# EAGLE design 180216RGDS_esquematico_Y7 (EAGLE 8.4.2)
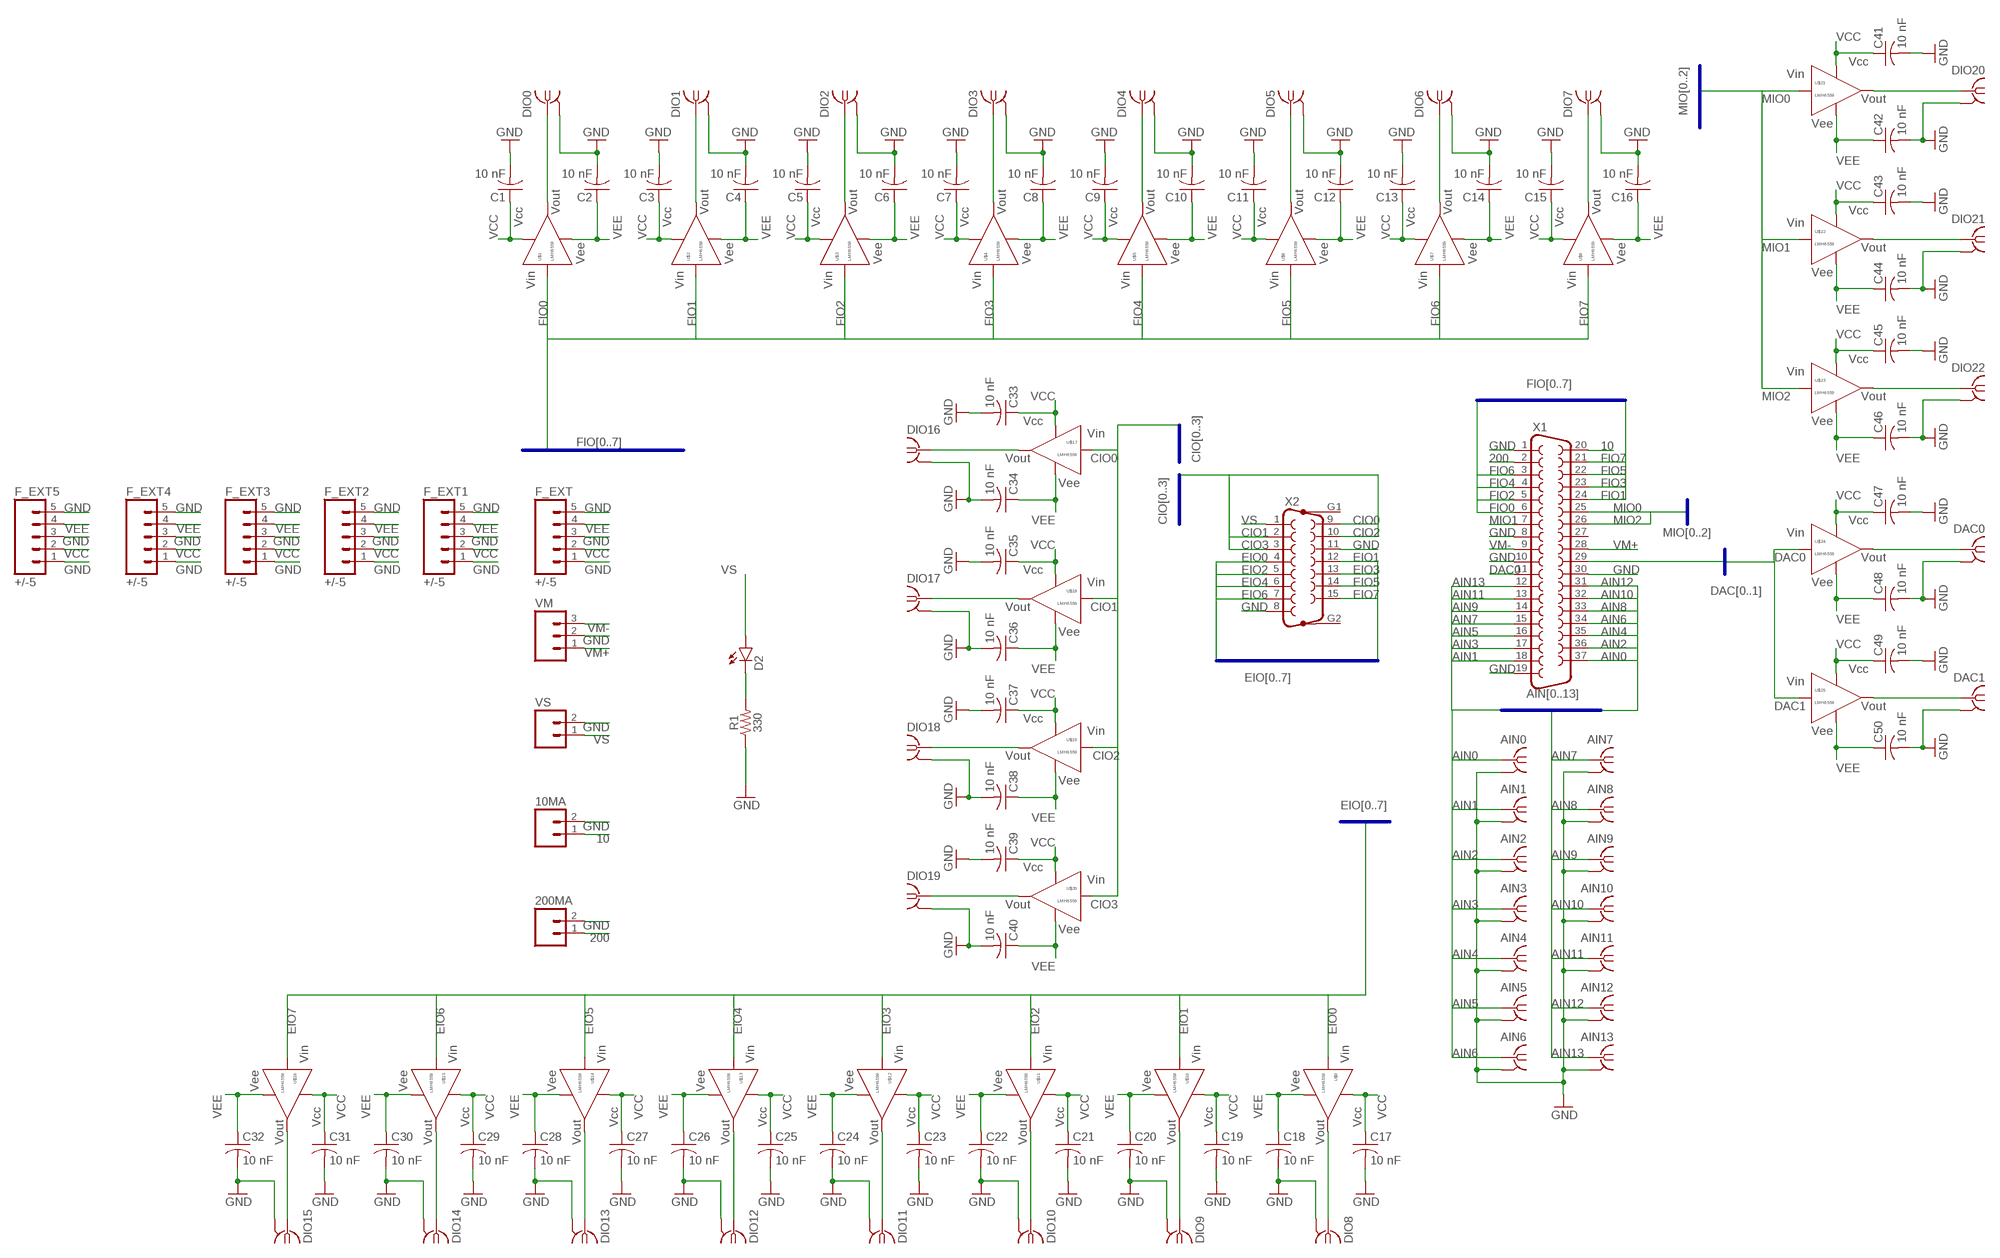
[diagram p0: schematic, sheet 1]

## Parts
10MA  M02PTH  [1X02]
200MA  M02PTH  [1X02]
AIN0  TE5227222-1  [VERTICAL_PCB&PANEL_TE]
AIN1  TE5227222-1  [VERTICAL_PCB&PANEL_TE]
AIN2  TE5227222-1  [VERTICAL_PCB&PANEL_TE]
AIN3  TE5227222-1  [VERTICAL_PCB&PANEL_TE]
AIN4  TE5227222-1  [VERTICAL_PCB&PANEL_TE]
AIN5  TE5227222-1  [VERTICAL_PCB&PANEL_TE]
AIN6  TE5227222-1  [VERTICAL_PCB&PANEL_TE]
AIN7  TE5227222-1  [VERTICAL_PCB&PANEL_TE]
AIN8  TE5227222-1  [VERTICAL_PCB&PANEL_TE]
AIN9  TE5227222-1  [VERTICAL_PCB&PANEL_TE]
AIN10  TE5227222-1  [VERTICAL_PCB&PANEL_TE]
AIN11  TE5227222-1  [VERTICAL_PCB&PANEL_TE]
AIN12  TE5227222-1  [VERTICAL_PCB&PANEL_TE]
AIN13  TE5227222-1  [VERTICAL_PCB&PANEL_TE]
C1  10 nF  C-USC1206K  [C1206K]
C2  10 nF  C-USC1206K  [C1206K]
C3  10 nF  C-USC1206K  [C1206K]
C4  10 nF  C-USC1206K  [C1206K]
C5  10 nF  C-USC1206K  [C1206K]
C6  10 nF  C-USC1206K  [C1206K]
C7  10 nF  C-USC1206K  [C1206K]
C8  10 nF  C-USC1206K  [C1206K]
C9  10 nF  C-USC1206K  [C1206K]
C10  10 nF  C-USC1206K  [C1206K]
C11  10 nF  C-USC1206K  [C1206K]
C12  10 nF  C-USC1206K  [C1206K]
C13  10 nF  C-USC1206K  [C1206K]
C14  10 nF  C-USC1206K  [C1206K]
C15  10 nF  C-USC1206K  [C1206K]
C16  10 nF  C-USC1206K  [C1206K]
C17  10 nF  C-USC1206K  [C1206K]
C18  10 nF  C-USC1206K  [C1206K]
C19  10 nF  C-USC1206K  [C1206K]
C20  10 nF  C-USC1206K  [C1206K]
C21  10 nF  C-USC1206K  [C1206K]
C22  10 nF  C-USC1206K  [C1206K]
C23  10 nF  C-USC1206K  [C1206K]
C24  10 nF  C-USC1206K  [C1206K]
C25  10 nF  C-USC1206K  [C1206K]
C26  10 nF  C-USC1206K  [C1206K]
C27  10 nF  C-USC1206K  [C1206K]
C28  10 nF  C-USC1206K  [C1206K]
C29  10 nF  C-USC1206K  [C1206K]
C30  10 nF  C-USC1206K  [C1206K]
C31  10 nF  C-USC1206K  [C1206K]
C32  10 nF  C-USC1206K  [C1206K]
C33  10 nF  C-USC1206K  [C1206K]
C34  10 nF  C-USC1206K  [C1206K]
C35  10 nF  C-USC1206K  [C1206K]
C36  10 nF  C-USC1206K  [C1206K]
C37  10 nF  C-USC1206K  [C1206K]
C38  10 nF  C-USC1206K  [C1206K]
C39  10 nF  C-USC1206K  [C1206K]
C40  10 nF  C-USC1206K  [C1206K]
C41  10 nF  C-USC1206K  [C1206K]
C42  10 nF  C-USC1206K  [C1206K]
C43  10 nF  C-USC1206K  [C1206K]
C44  10 nF  C-USC1206K  [C1206K]
C45  10 nF  C-USC1206K  [C1206K]
C46  10 nF  C-USC1206K  [C1206K]
C47  10 nF  C-USC1206K  [C1206K]
C48  10 nF  C-USC1206K  [C1206K]
C49  10 nF  C-USC1206K  [C1206K]
C50  10 nF  C-USC1206K  [C1206K]
D2  LED5MM  [LED5MM]
DAC0  TE5227222-1  [VERTICAL_PCB&PANEL_TE]
DAC1  TE5227222-1  [VERTICAL_PCB&PANEL_TE]
DIO0  TE5227222-1  [VERTICAL_PCB&PANEL_TE]
DIO1  TE5227222-1  [VERTICAL_PCB&PANEL_TE]
DIO2  TE5227222-1  [VERTICAL_PCB&PANEL_TE]
DIO3  TE5227222-1  [VERTICAL_PCB&PANEL_TE]
DIO4  TE5227222-1  [VERTICAL_PCB&PANEL_TE]
DIO5  TE5227222-1  [VERTICAL_PCB&PANEL_TE]
DIO6  TE5227222-1  [VERTICAL_PCB&PANEL_TE]
DIO7  TE5227222-1  [VERTICAL_PCB&PANEL_TE]
DIO8  TE5227222-1  [VERTICAL_PCB&PANEL_TE]
DIO9  TE5227222-1  [VERTICAL_PCB&PANEL_TE]
DIO10  TE5227222-1  [VERTICAL_PCB&PANEL_TE]
DIO11  TE5227222-1  [VERTICAL_PCB&PANEL_TE]
DIO12  TE5227222-1  [VERTICAL_PCB&PANEL_TE]
DIO13  TE5227222-1  [VERTICAL_PCB&PANEL_TE]
DIO14  TE5227222-1  [VERTICAL_PCB&PANEL_TE]
DIO15  TE5227222-1  [VERTICAL_PCB&PANEL_TE]
DIO16  TE5227222-1  [VERTICAL_PCB&PANEL_TE]
DIO17  TE5227222-1  [VERTICAL_PCB&PANEL_TE]
DIO18  TE5227222-1  [VERTICAL_PCB&PANEL_TE]
DIO19  TE5227222-1  [VERTICAL_PCB&PANEL_TE]
DIO20  TE5227222-1  [VERTICAL_PCB&PANEL_TE]
DIO21  TE5227222-1  [VERTICAL_PCB&PANEL_TE]
DIO22  TE5227222-1  [VERTICAL_PCB&PANEL_TE]
F_EXT  +/-5  M05PTH  [1X05]
F_EXT1  +/-5  M05PTH  [1X05]
F_EXT2  +/-5  M05PTH  [1X05]
F_EXT3  +/-5  M05PTH  [1X05]
F_EXT4  +/-5  M05PTH  [1X05]
F_EXT5  +/-5  M05PTH  [1X05]
R1  330  330OHM-HORIZ-1/10W-5%  [AXIAL-0.3]
U$1  LMH6559  [SO08]
U$2  LMH6559  [SO08]
U$3  LMH6559  [SO08]
U$4  LMH6559  [SO08]
U$5  LMH6559  [SO08]
U$6  LMH6559  [SO08]
U$7  LMH6559  [SO08]
U$8  LMH6559  [SO08]
U$9  LMH6559  [SO08]
U$10  LMH6559  [SO08]
U$11  LMH6559  [SO08]
U$12  LMH6559  [SO08]
U$13  LMH6559  [SO08]
U$14  LMH6559  [SO08]
U$15  LMH6559  [SO08]
U$16  LMH6559  [SO08]
U$17  LMH6559  [SO08]
U$18  LMH6559  [SO08]
U$19  LMH6559  [SO08]
U$20  LMH6559  [SO08]
U$21  LMH6559  [SO08]
U$22  LMH6559  [SO08]
U$23  LMH6559  [SO08]
U$24  LMH6559  [SO08]
U$25  LMH6559  [SO08]
VM  M03PTH  [1X03]
VS  M02PTH  [1X02]
X1  F37HP  [F37HP]
X2  F15HP  [F15HP]

## Nets
10: 10MA.1 X1.20
200: 200MA.1 X1.2
AIN0: AIN0.S X1.37
AIN1: AIN1.S X1.18
AIN2: AIN2.S X1.36
AIN3: AIN3.S X1.17
AIN4: AIN4.S X1.35
AIN5: AIN5.S X1.16
AIN6: AIN6.S X1.34
AIN7: AIN7.S X1.15
AIN8: AIN8.S X1.33
AIN9: AIN9.S X1.14
AIN10: AIN10.S X1.32
AIN11: AIN11.S X1.13
AIN12: AIN12.S X1.31
AIN13: AIN13.S X1.12
CIO0: U$17.4(VIN) X2.9
CIO1: U$18.4(VIN) X2.2
CIO2: U$19.4(VIN) X2.10
CIO3: U$20.4(VIN) X2.3
DAC0: U$24.4(VIN) X1.11
DAC1: U$25.4(VIN) X1.29
EIO0: U$9.4(VIN) X2.4
EIO1: U$10.4(VIN) X2.12
EIO2: U$11.4(VIN) X2.5
EIO3: U$12.4(VIN) X2.13
EIO4: U$13.4(VIN) X2.6
EIO5: U$14.4(VIN) X2.14
EIO6: U$15.4(VIN) X2.7
EIO7: U$16.4(VIN) X2.15
FIO0: U$1.4(VIN) X1.6
FIO1: U$2.4(VIN) X1.24
FIO2: U$3.4(VIN) X1.5
FIO3: U$4.4(VIN) X1.23
FIO4: U$5.4(VIN) X1.4
FIO5: U$6.4(VIN) X1.22
FIO6: U$7.4(VIN) X1.3
FIO7: U$8.4(VIN) X1.21
GND: 10MA.2 200MA.2 AIN0.G AIN1.G AIN2.G AIN3.G AIN4.G AIN5.G AIN6.G AIN7.G AIN8.G AIN9.G AIN10.G AIN11.G AIN12.G AIN13.G C1.2 C2.2 C3.2 C4.2 C5.2 C6.2 C7.2 C8.2 C9.2 C10.2 C11.2 C12.2 C13.2 C14.2 C15.2 C16.2 C17.2 C18.2 C19.2 C20.2 C21.2 C22.2 C23.2 C24.2 C25.2 C26.2 C27.2 C28.2 C29.2 C30.2 C31.2 C32.2 C33.2 C34.2 C35.2 C36.2 C37.2 C38.2 C39.2 C40.2 C41.2 C42.2 C43.2 C44.2 C45.2 C46.2 C47.2 C48.2 C49.2 C50.2 DAC0.G DAC1.G DIO0.G DIO1.G DIO2.G DIO3.G DIO4.G DIO5.G DIO6.G DIO7.G DIO8.G DIO9.G DIO10.G DIO11.G DIO12.G DIO13.G DIO14.G DIO15.G DIO16.G DIO17.G DIO18.G DIO19.G DIO20.G DIO21.G DIO22.G F_EXT1.1 F_EXT1.3 F_EXT1.5 F_EXT2.1 F_EXT2.3 F_EXT2.5 F_EXT3.1 F_EXT3.3 F_EXT3.5 F_EXT4.1 F_EXT4.3 F_EXT4.5 F_EXT5.1 F_EXT5.3 F_EXT5.5 F_EXT.1 F_EXT.3 F_EXT.5 R1.P$1 VM.2 VS.2 X1.1 X1.8 X1.10 X1.19 X1.30 X2.8 X2.11
MIO0: U$21.4(VIN) X1.25
MIO1: U$22.4(VIN) X1.7
MIO2: U$23.4(VIN) X1.26
N$1: DIO0.S U$1.8(VOUT)
N$3: D2.K(C) R1.P$2
N$4: DIO1.S U$2.8(VOUT)
N$5: DIO2.S U$3.8(VOUT)
N$6: DIO3.S U$4.8(VOUT)
N$7: DIO4.S U$5.8(VOUT)
N$8: DIO5.S U$6.8(VOUT)
N$9: DIO6.S U$7.8(VOUT)
N$10: DIO7.S U$8.8(VOUT)
N$11: DIO8.S U$9.8(VOUT)
N$12: DIO9.S U$10.8(VOUT)
N$13: DIO10.S U$11.8(VOUT)
N$14: DIO11.S U$12.8(VOUT)
N$15: DIO12.S U$13.8(VOUT)
N$16: DIO13.S U$14.8(VOUT)
N$17: DIO14.S U$15.8(VOUT)
N$18: DIO15.S U$16.8(VOUT)
N$19: DIO16.S U$17.8(VOUT)
N$20: DIO17.S U$18.8(VOUT)
N$21: DIO18.S U$19.8(VOUT)
N$22: DIO19.S U$20.8(VOUT)
N$23: DIO20.S U$21.8(VOUT)
N$24: DIO21.S U$22.8(VOUT)
N$25: DIO22.S U$23.8(VOUT)
N$26: DAC0.S U$24.8(VOUT)
N$27: DAC1.S U$25.8(VOUT)
VCC [power]: C1.1 C3.1 C5.1 C7.1 C9.1 C11.1 C13.1 C15.1 C17.1 C19.1 C21.1 C23.1 C25.1 C27.1 C29.1 C31.1 C33.1 C35.1 C37.1 C39.1 C41.1 C43.1 C45.1 C47.1 C49.1 F_EXT1.2 F_EXT2.2 F_EXT3.2 F_EXT4.2 F_EXT5.2 F_EXT.2 U$1.1(VCC) U$2.1(VCC) U$3.1(VCC) U$4.1(VCC) U$5.1(VCC) U$6.1(VCC) U$7.1(VCC) U$8.1(VCC) U$9.1(VCC) U$10.1(VCC) U$11.1(VCC) U$12.1(VCC) U$13.1(VCC) U$14.1(VCC) U$15.1(VCC) U$16.1(VCC) U$17.1(VCC) U$18.1(VCC) U$19.1(VCC) U$20.1(VCC) U$21.1(VCC) U$22.1(VCC) U$23.1(VCC) U$24.1(VCC) U$25.1(VCC)
VEE [power]: C2.1 C4.1 C6.1 C8.1 C10.1 C12.1 C14.1 C16.1 C18.1 C20.1 C22.1 C24.1 C26.1 C28.1 C30.1 C32.1 C34.1 C36.1 C38.1 C40.1 C42.1 C44.1 C46.1 C48.1 C50.1 F_EXT1.4 F_EXT2.4 F_EXT3.4 F_EXT4.4 F_EXT5.4 F_EXT.4 U$1.5(VEE) U$2.5(VEE) U$3.5(VEE) U$4.5(VEE) U$5.5(VEE) U$6.5(VEE) U$7.5(VEE) U$8.5(VEE) U$9.5(VEE) U$10.5(VEE) U$11.5(VEE) U$12.5(VEE) U$13.5(VEE) U$14.5(VEE) U$15.5(VEE) U$16.5(VEE) U$17.5(VEE) U$18.5(VEE) U$19.5(VEE) U$20.5(VEE) U$21.5(VEE) U$22.5(VEE) U$23.5(VEE) U$24.5(VEE) U$25.5(VEE)
VM+: VM.1 X1.28
VM-: VM.3 X1.9
VS: D2.A VS.1 X2.1
Unconnected: X1.27 X2.G1 X2.G2

## Buses
CIO[0..3]
EIO[0..7]
FIO[0..7]
MIO[0..2]
AIN[0..13]
DAC[0..1]

## Library data of the parts
10MA 200MA VS = SparkFun-Connectors:M02: Standard 2-pin 0.1" header. Use with - straight break away headers ( PRT-00116) - right angle break away headers (PRT-00553) - swiss pins (PRT-00743) - machine pins (PRT-00117) - female headers (PRT-00115) Molex polarized connector foot print use with: PRT-08233 with associated crimp pins and housings. 2.54_SCREWTERM for use with PRT-10571. 3.5mm Screw Terminal footprints for PRT-08084 5mm Screw Terminal footprints for use with PRT-08432
AIN0 AIN1-AIN13 DAC0 DAC1 DIO0 DIO1-DIO22 = bnc:TE5227222-1
C1-C50 = rcl:C-US: CAPACITOR, American symbol
D2 = SparkFun-LED:LED: LEDs Standard schematic elements and footprints for 5mm, 3mm, 1206, and 0603 sized LEDs. 5mm - Spark Fun Electronics SKU : COM-00529 (and others)
F_EXT F_EXT1-F_EXT5 = SparkFun-Connectors:M05: Header 5 Standard 5-pin 0.1" header. Use with straight break away headers (SKU : PRT-00116), right angle break away headers (PRT-00553), swiss pins (PRT-00743), machine pins (PRT-00117), and female headers (PRT-00115). Molex polarized connector foot print use with SKU : PRT-08230 with associated crimp pins and housings.
R1 = SparkFun-Resistors:330OHM: 330Ω resistor A resistor is a passive two-terminal electrical component that implements electrical resistance as a circuit element. Resistors act to reduce current flow, and, at the same time, act to lower voltage levels within circuits. - Wikipedia; PROD_ID: RES-8371
U$1-U$25 = Analog:LMH6559
VM = SparkFun-Connectors:M03: Header 3 Standard 3-pin 0.1" header. Use with straight break away headers (SKU : PRT-00116), right angle break away headers (PRT-00553), swiss pins (PRT-00743), machine pins (PRT-00117), and female headers (PRT-00115). Molex polarized connector foot print use with SKU : PRT-08232 with associated crimp pins and housings.
X1 = con-subd:F37: SUB-D; OC_FARNELL: unknown; OC_NEWARK: unknown
X2 = con-subd:F15HP: SUB-D; OC_FARNELL: unknown; OC_NEWARK: unknown

## Net classes
0 default: width 0.3 mm, clearance 0.3 mm
1 power: width 0.6 mm, clearance 0.3 mm

## Board
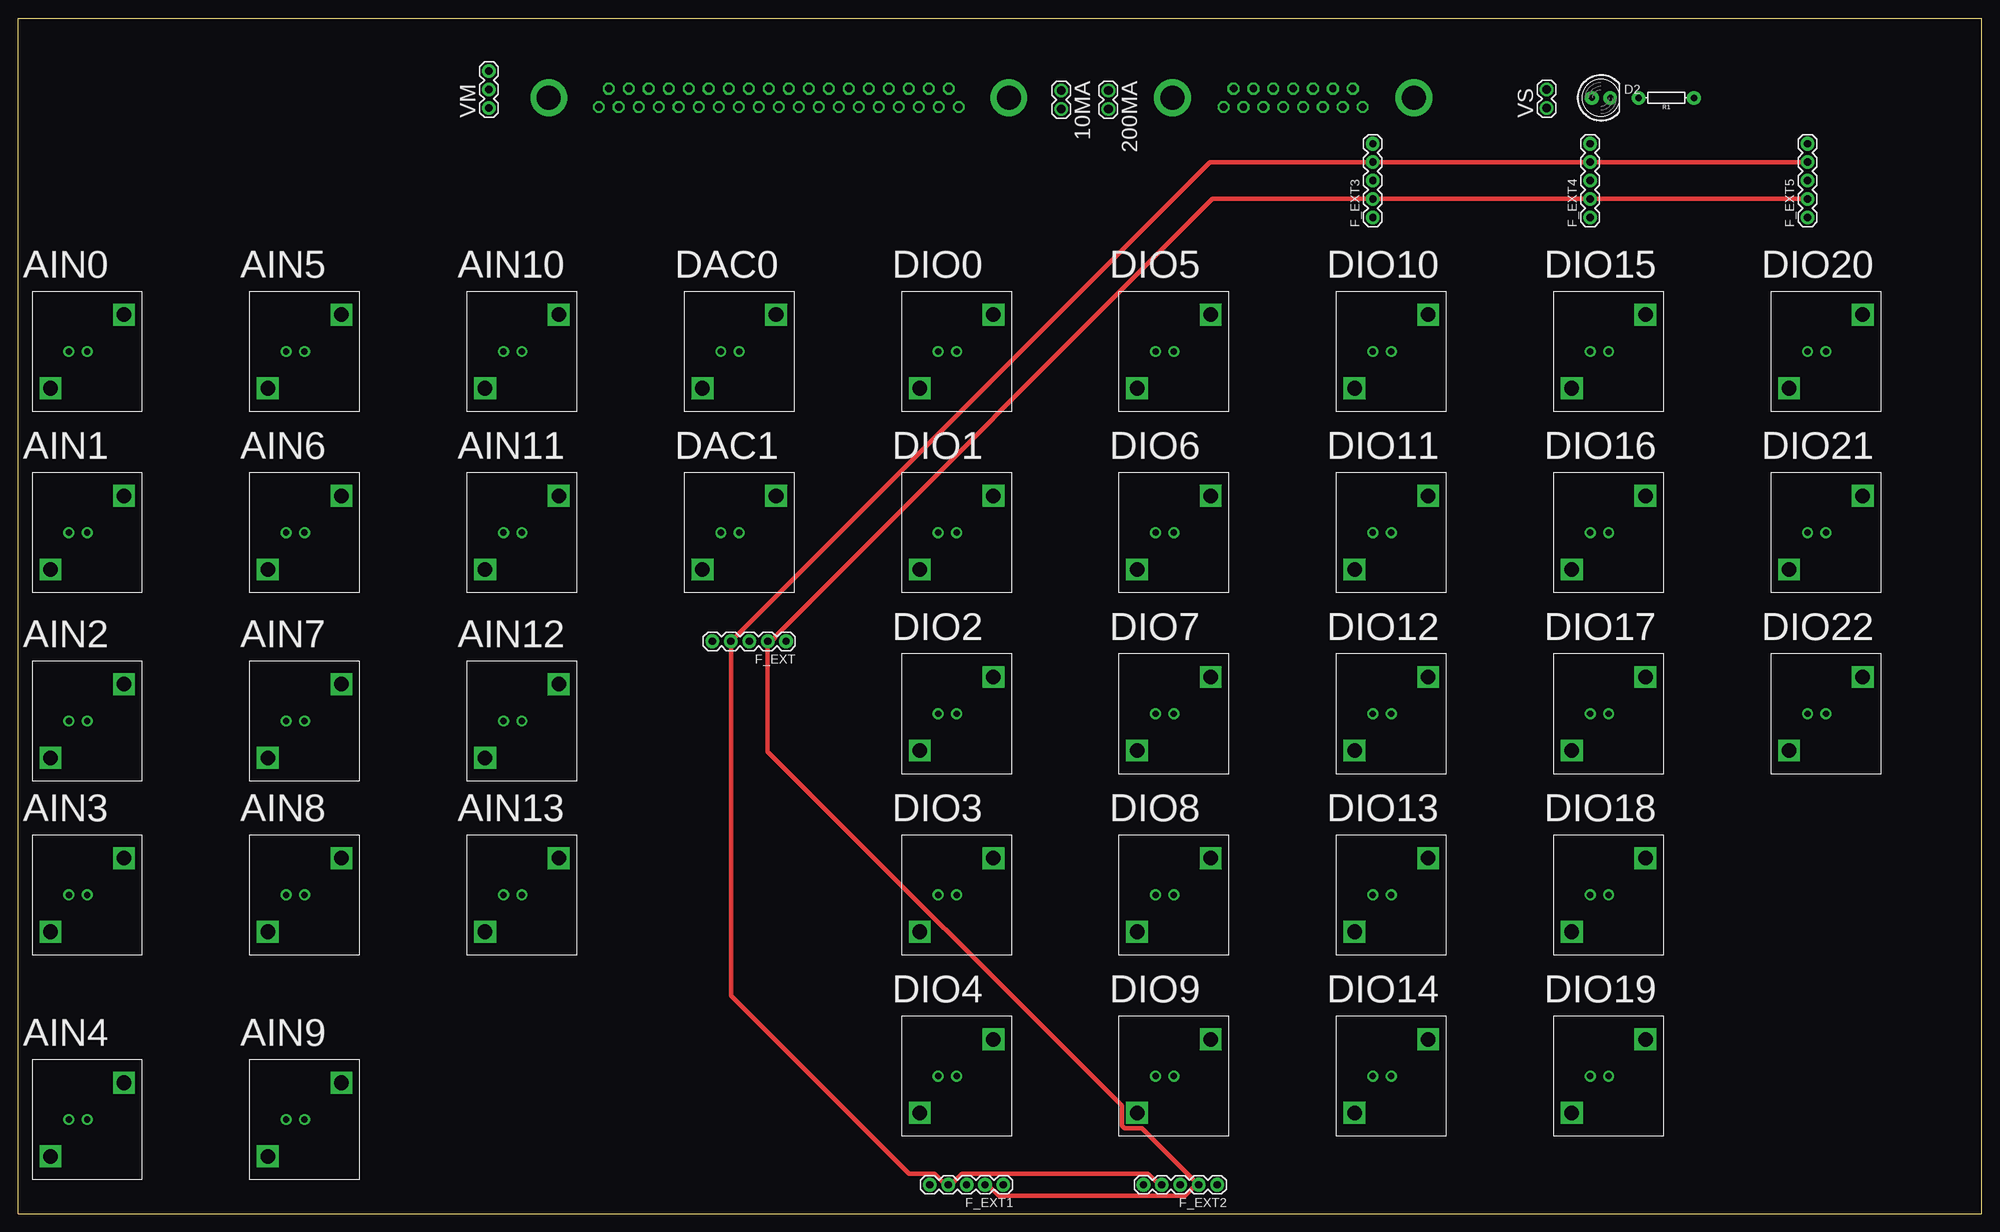
[diagram p1: board, top side]
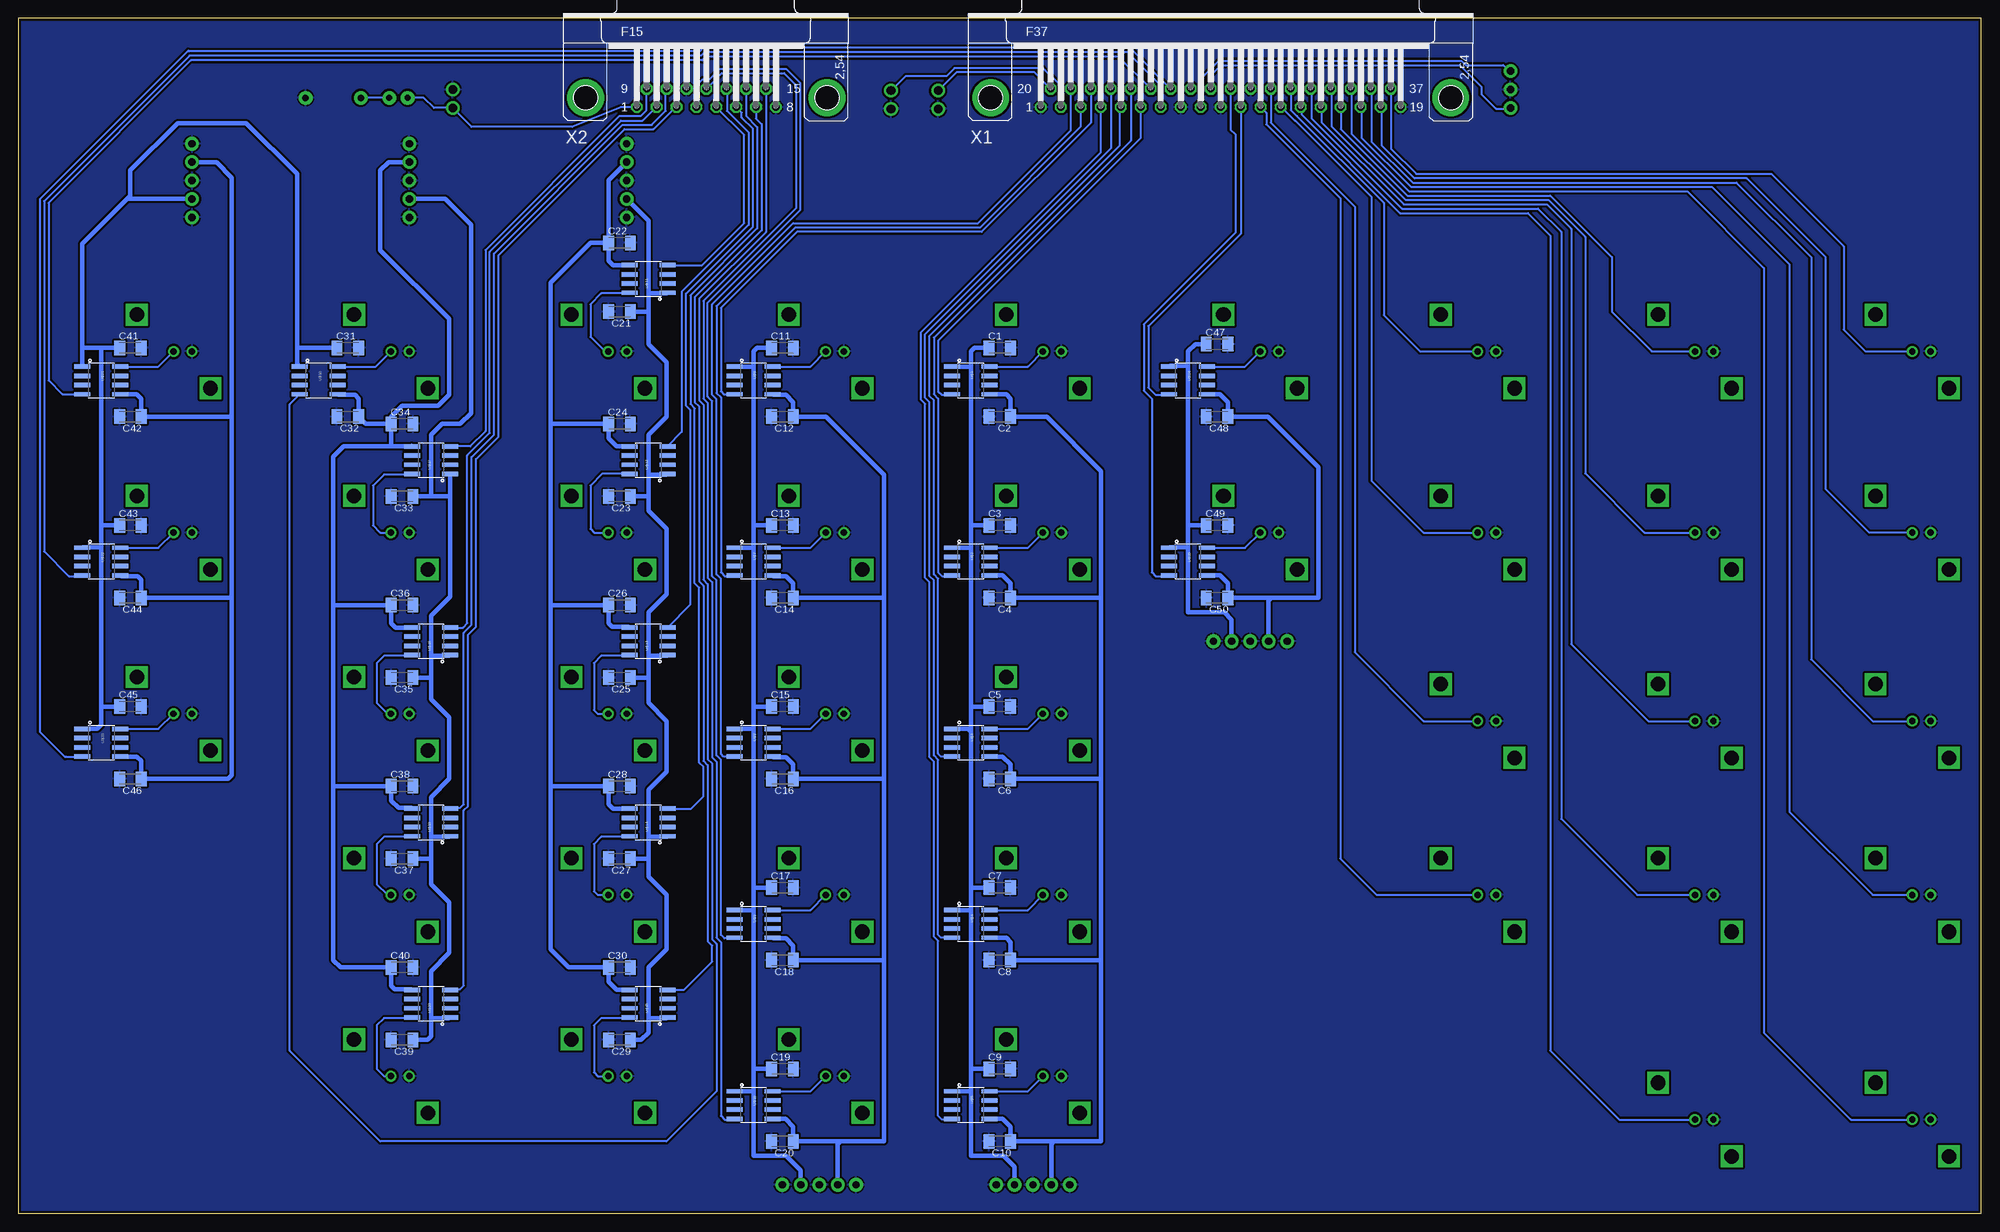
[diagram p2: board, bottom side, seen from below]

Size 271 x 165 mm. Coordinates in mm from the lower left corner, seen from the top.
Outline: 0,0 271,0 271,165 0,165 0,0
Copper layers (1*16): Top 0.035mm / dielectric 1.5mm / Bottom 0.035mm
Design rules "SparkFun": minimum track width 8mil, minimum drill 20mil, track to track 8mil, track to pad 8mil, pad to pad 8mil, via to via 8mil, smd to smd 8mil, copper to edge 10mil, drill to drill 8mil, minimum pad ring 12mil, minimum via ring 10mil, stop-mask expansion 4mil, vias tented up to drill 25mil, thermal gap 10mil

### Footprints (pad centres in the part's own frame; a part is rotated, then mirrored left to right if it is on the bottom)
1X02 = drill 1.2 pad 1.88: 1 0,0; 2 2.54,0
VERTICAL_PCB&PANEL_TE = drill 0.889: G 0,0; S 2.54,0 | drill 2.007 square: P$1 -2.54,-5.08; P$4 7.62,5.08
C1206K = smd 1.5 x 2: 1 -1.5,0; 2 1.5,0
LED5MM = drill 0.813 pad 1.88: A -1.27,0; K 1.27,0
1X05 = drill 1.016 pad 1.88: 1 0,0; 2 2.54,0; 3 5.08,0; 4 7.62,0; 5 10.16,0
AXIAL-0.3 = drill 0.9 pad 1.88: P$1 -3.81,0; P$2 3.81,0
SO08 = smd 0.61 x 2.21: 1 -1.905,-2.616; 2 -0.635,-2.616; 3 0.635,-2.616; 4 1.905,-2.616; 5 1.905,2.616; 6 0.635,2.616; 7 -0.635,2.616; 8 -1.905,2.616
1X03 = drill 1.016 pad 1.88: 1 0,0; 2 2.54,0; 3 5.08,0
F37HP = drill 1.016 octagon: 1 -24.841,-1.27; 2 -22.073,-1.27; 3 -19.329,-1.27; 4 -16.561,-1.27; 5 -13.792,-1.27; 6 -11.049,-1.27; 7 -8.28,-1.27; 8 -5.512,-1.27; 9 -2.769,-1.27; 10 0,-1.27; 11 2.769,-1.27; 12 5.512,-1.27; 13 8.28,-1.27; 14 11.049,-1.27; 15 13.818,-1.27; 16 16.561,-1.27; 17 19.329,-1.27; 18 22.098,-1.27; 19 24.841,-1.27; 20 -23.47,1.27; 21 -20.701,1.27; 22 -17.932,1.27; 23 -15.189,1.27; 24 -12.421,1.27; 25 -9.652,1.27; 26 -6.909,1.27; 27 -4.14,1.27; 28 -1.372,1.27; 29 1.372,1.27; 30 4.14,1.27; 31 6.909,1.27; 32 9.677,1.27; 33 12.421,1.27; 34 15.189,1.27; 35 17.958,1.27; 36 20.701,1.27; 37 23.47,1.27 | drill 3.302 pad 5.08: G1 -31.75,0; G2 31.75,0
F15HP = drill 1.016 octagon: 1 -9.601,-1.27; 2 -6.858,-1.27; 3 -4.115,-1.27; 4 -1.372,-1.27; 5 1.372,-1.27; 6 4.115,-1.27; 7 6.858,-1.27; 8 9.601,-1.27; 9 -8.23,1.27; 10 -5.486,1.27; 11 -2.743,1.27; 12 0,1.27; 13 2.743,1.27; 14 5.486,1.27; 15 8.23,1.27 | drill 3.302 pad 5.08: G1 -16.662,0; G2 16.662,0

### Placement (x,y rotation side)
10MA  144,155 270 top
200MA  150.5,155 270 top
AIN0  7,119 0 top
AIN1  7,94 0 top
AIN2  7,68 0 top
AIN3  7,44 0 top
AIN4  7,13 0 top
AIN5  37,119 0 top
AIN6  37,94 0 top
AIN7  37,68 0 top
AIN8  37,44 0 top
AIN9  37,13 0 top
AIN10  67,119 0 top
AIN11  67,94 0 top
AIN12  67,68 0 top
AIN13  67,44 0 top
C1  135.5,119.5 0 bottom
C2  135.5,110 180 bottom
C3  135.5,95 0 bottom
C4  135.5,85 180 bottom
C5  135.5,70 0 bottom
C6  135.5,60 180 bottom
C7  135.5,45 0 bottom
C8  135.5,35 180 bottom
C9  135.5,20 0 bottom
C10  135.5,10 180 bottom
C11  165.5,119.5 0 bottom
C12  165.5,110 180 bottom
C13  165.5,95 0 bottom
C14  165.5,85 180 bottom
C15  165.5,70 0 bottom
C16  165.5,60 180 bottom
C17  165.5,45 0 bottom
C18  165.5,35 180 bottom
C19  165.5,20 0 bottom
C20  165.5,10 180 bottom
C21  188,124.5 180 bottom
C22  188,134 0 bottom
C23  188,99 180 bottom
C24  188,109 0 bottom
C25  188,74 180 bottom
C26  188,84 0 bottom
C27  188,49 180 bottom
C28  188,59 0 bottom
C29  188,24 180 bottom
C30  188,34 0 bottom
C31  225.5,119.5 0 bottom
C32  225.5,110 180 bottom
C33  218,99 180 bottom
C34  218,109 0 bottom
C35  218,74 180 bottom
C36  218,84 0 bottom
C37  218,49 180 bottom
C38  218,59 0 bottom
C39  218,24 180 bottom
C40  218,34 0 bottom
C41  255.5,119.5 0 bottom
C42  255.5,110 180 bottom
C43  255.5,95 0 bottom
C44  255.5,85 180 bottom
C45  255.5,70 0 bottom
C46  255.5,60 180 bottom
C47  105.5,120 0 bottom
C48  105.5,110 180 bottom
C49  105.5,95 0 bottom
C50  105.5,85 180 bottom
D2  218.5,154 0 top
DAC0  97,119 0 top
DAC1  97,94 0 top
DIO0  127,119 0 top
DIO1  127,94 0 top
DIO2  127,69 0 top
DIO3  127,44 0 top
DIO4  127,19 0 top
DIO5  157,119 0 top
DIO6  157,94 0 top
DIO7  157,69 0 top
DIO8  157,44 0 top
DIO9  157,19 0 top
DIO10  187,119 0 top
DIO11  187,94 0 top
DIO12  187,69 0 top
DIO13  187,44 0 top
DIO14  187,19 0 top
DIO15  217,119 0 top
DIO16  217,94 0 top
DIO17  217,69 0 top
DIO18  217,44 0 top
DIO19  217,19 0 top
DIO20  247,119 0 top
DIO21  247,94 0 top
DIO22  247,69 0 top
F_EXT  106,79 180 top
F_EXT1  136,4 180 top
F_EXT2  165.5,4 180 top
F_EXT3  187,137.5 90 top
F_EXT4  217,137.5 90 top
F_EXT5  247,137.5 90 top
R1  227.5,154 180 top
U$1  139.5,115 270 bottom
U$2  139.5,90 270 bottom
U$3  139.5,65 270 bottom
U$4  139.5,40 270 bottom
U$5  139.5,15 270 bottom
U$6  169.5,115 270 bottom
U$7  169.5,90 270 bottom
U$8  169.5,65 270 bottom
U$9  169.5,40 270 bottom
U$10  169.5,15 270 bottom
U$11  184,129 90 bottom
U$12  184,104 90 bottom
U$13  184,79 90 bottom
U$14  184,54 90 bottom
U$15  184,29 90 bottom
U$16  229.5,115 270 bottom
U$17  214,104 90 bottom
U$18  214,79 90 bottom
U$19  214,54 90 bottom
U$20  214,29 90 bottom
U$21  259.5,115 270 bottom
U$22  259.5,90 270 bottom
U$23  259.5,65 270 bottom
U$24  109.5,115 270 bottom
U$25  109.5,90 270 bottom
VM  65,152.6 90 top
VS  211,152.6 90 top
X1  105,154 0 bottom
X2  176,154 0 bottom

### Tracks (layer width: path | path; a pad name or v marks a point on that pad's centre or on a via)
10
  Bottom 0.3: X1.20 130.7,157.5 141.5,157.5 10MA.1
200
  Bottom 0.3: X1.2 127.21,152.86 127.21,155.79 129.51,158.1 141.75,158.1 142.85,157 148.5,157 200MA.1
AIN0
  Bottom 0.3: X1.37 81.5,155.24 81.5,147 78,143.5 29,143.5 19,133.5 19,122 16,119 AIN0.S
AIN1
  Bottom 0.3: X1.18 82.79,152.62 82.79,147.44 78.25,142.9 32.4,142.9 21.5,132 21.5,100 15.5,94 AIN1.S
AIN2
  Bottom 0.3: X1.36 84.17,155.14 84.17,147.97 78.5,142.3 33.8,142.3 23.5,132 23.5,76.5 15,68 AIN2.S
AIN3
  Bottom 0.3: X1.17 85.56,152.62 85.56,148.52 78.75,141.7 37.2,141.7 26.5,131 26.5,55.5 15,44 AIN3.S
AIN4
  Bottom 0.3: X1.35 86.93,155.16 86.93,149.04 78.99,141.1 40.6,141.1 30,130.5 30,25 18,13 AIN4.S
AIN5
  Bottom 0.3: X1.16 88.44,149.7 79.24,140.5 59.5,140.5 51,132 51,124.5 45.5,119 AIN5.S
AIN6
  Bottom 0.3: X1.34 89.7,155.16 89.7,150.11 79.49,139.9 59.75,139.9 54.67,134.83 54.67,102.17 46.5,94 AIN6.S
AIN7
  Bottom 0.3: X1.15 91.07,152.62 91.07,150.63 79.74,139.3 60,139.3 56.6,135.9 56.6,78.6 46,68 AIN7.S
AIN8
  Bottom 0.3: X1.33 92.44,155.14 92.44,151.16 79.99,138.7 61.2,138.7 58,135.5 58,54.5 47.5,44 AIN8.S
AIN9
  Bottom 0.3: X1.14 93.84,152.62 93.84,151.7 80.24,138.1 62.6,138.1 59.5,135 59.5,22.5 50,13 AIN9.S
AIN10
  Bottom 0.3: X1.32 95.32,152.32 94.47,151.47 82.5,139.5 82.5,124 77.5,119 AIN10.S
AIN11
  Bottom 0.3: X1.13 96.58,152.73 94.72,150.87 84.17,140.33 84.17,101.17 77,94 AIN11.S
AIN12
  Bottom 0.3: X1.31 98.09,150.59 86.5,139 86.5,77.5 77,68 AIN12.S
AIN13
  Bottom 0.3: X1.12 98.69,151.93 98.69,150.34 88.5,140.15 88.5,49 83.5,44 AIN13.S
CIO0
  Bottom 0.3: X2.9 184.34,155.16 184.34,152.21 185.08,151.47 188.03,151.47 206.5,133 206.5,108 208.59,105.91 U$17.4
CIO1
  Bottom 0.3: U$18.4 209.59,80.91 209,81.5 209,104.65 205.9,107.75 205.9,132.75 187.78,150.87 184.83,150.87 182.97,152.73 182.97,152.84 X2.2
CIO2
  Bottom 0.3: 211.29,56 U$19.4 211.29,56 | 211.29,56 210,56 209.5,56.5 209.5,80.15 208.4,81.25 208.4,104.4 205.3,107.5 205.3,132.5 187.53,150.27 183.53,150.27 181.59,152.21 181.59,155.16 X2.10
CIO3
  Bottom 0.3: U$20.4 211.29,31 210,31 209.5,31.5 209.5,55.65 208.9,56.25 208.9,79.9 207.8,81 207.8,104.15 204.7,107.25 204.7,132.25 187.29,149.67 183.29,149.67 180.22,152.73 X2.3
DAC0
  Bottom 0.3: X1.11 102.23,135.27 115,122.5 115,114 114,113 112.21,113 U$24.4
DAC1
  Bottom 0.3: X1.29 103.63,149.63 103,149 103,135.35 115.6,122.75 115.6,113.6 114.5,112.5 114.5,88.5 114,88 112.21,88 U$25.4
EIO0
  Bottom 0.3: U$9.4 172.21,38 173.5,38 174,38.5 174,62.65 174.6,63.25 174.6,87.4 175.2,88 175.2,112.15 175.8,112.75 175.8,125.75 163,138.55 163,156 165,158 174.12,158 175.59,156.53 176.52,156.53 177.26,155.79 177.26,152.84 X2.4
EIO1
  Bottom 0.3: X2.12 173.87,157.4 165.25,157.4 163.6,155.75 163.6,138.79 176.4,125.99 176.4,112.51 175.8,111.91 175.8,87.75 175.2,87.15 175.2,63 174.6,62.4 174.6,38.1 174,37.5 174,13.5 173.5,13 172.21,13 U$10.4
EIO2
  Bottom 0.3: U$11.4 176.58,130.91 170.77,136.72 170.77,148.87 X2.5
EIO3
  Bottom 0.3: U$12.4 179.4,107.89 179.4,127.24 170.17,136.47 170.17,149.23 173.15,152.21 173.15,155.16 X2.13
EIO4
  Bottom 0.3: U$13.4 178.2,84.09 178.2,90.5 178.2,110.91 178.8,111.51 178.8,126.99 169.57,136.22 169.57,149.72 171.11,151.26 171.11,151.96 X2.6
EIO5
  Bottom 0.3: U$14.4 178.09,55.91 176.4,57.6 176.4,61.66 177,62.26 177,86.41 177.6,87.01 177.6,111.16 178.2,111.76 178.2,126.74 168.97,135.97 168.97,149.97 170.51,151.51 X2.14
EIO6
  Bottom 0.3: X2.7 169.14,151.14 168.37,150.37 168.37,135.72 177.6,126.49 177.6,112.01 177,111.41 177,87.26 176.4,86.66 176.4,62.51 175.8,61.91 175.8,37.6 175.2,37 175.2,34.8 179.09,30.91 U$15.4
EIO7
  Bottom 0.3: X2.15 167.77,135.47 177,126.24 177,112.26 176.4,111.66 176.4,87.51 175.8,86.91 175.8,62.75 175.2,62.15 175.2,37.85 174.6,37.25 174.6,16.9 181.5,10 221,10 233.5,22.5 233.5,111.71 U$16.4
FIO0
  Bottom 0.3: X1.6 116.05,148.45 144,120.5 144,113.5 143.5,113 142.21,113 U$1.4
FIO1
  Bottom 0.3: X1.24 117.42,148.08 144.6,120.9 144.6,113.1 144,112.5 144,88.5 143.5,88 142.21,88 U$2.4
FIO2
  Bottom 0.3: U$3.4 143.59,63.09 144,63.5 144,87.65 144.6,88.25 144.6,112.25 145.2,112.85 145.2,121.15 118.92,147.42 118.92,152.6 X1.5
FIO3
  Bottom 0.3: U$4.4 143.59,38.09 144,38.5 144,62.65 144.6,63.25 144.6,87.4 145.2,88 145.2,112 145.8,112.6 145.8,121.4 120.1,147.1 120.1,155.18 X1.23
FIO4
  Bottom 0.3: U$5.4 142.21,13 143.5,13 144,13.5 144,37.65 144.6,38.25 144.6,62.4 145.2,63 145.2,87.15 145.8,87.75 145.8,111.75 146.4,112.35 146.4,121.65 136.52,131.52 | 136.52,131.52 | 136.52,131.52 121.56,146.49 X1.4
FIO5
  Bottom 0.3: X1.22 122.93,150.57 138,135.5 163.5,135.5 174,125 174,113.5 173.59,113.09 U$6.4
FIO6
  Bottom 0.3: X1.3 124.33,150.02 138.25,136.1 163.75,136.1 174.6,125.25 174.6,113.25 174,112.65 174,88.5 173.5,88 172.21,88 U$7.4
FIO7
  Bottom 0.3: U$8.4 173.59,63.09 174,63.5 174,87.65 174.6,88.25 174.6,112.4 175.2,113 175.2,125.5 164,136.7 138.5,136.7 125.7,149.5 X1.21
GND
  pour Bottom (isolate 0.3): 0,165 271,165 271,0 0,0
MIO0
  Bottom 0.3: U$21.4 264.89,113.09 266.8,115 266.8,139.5 247.15,159.15 176.55,159.15 176,159.7 119.08,159.7 X1.25
MIO1
  Bottom 0.3: U$22.4 262.21,88 264,88 267.4,91.4 267.4,139.75 247.33,159.83 176.72,159.83 176.25,160.3 117.9,160.3 113.39,155.79 113.39,152.84 X1.7
MIO2
  Bottom 0.3: U$23.4 264.4,63.09 264.5,63 268,66.5 268,140 247.5,160.5 247.43,160.43 176.97,160.43 176.49,160.9 117.54,160.9 X1.26
N$1
  Bottom 0.3: U$1.8 131.63,116.91 DIO0.S
N$3
  Bottom 0.3: D2.K R1.P$2
N$4
  Bottom 0.3: U$2.8 131.63,91.91 DIO1.S
N$5
  Bottom 0.3: U$3.8 131.63,66.91 DIO2.S
N$6
  Bottom 0.3: U$4.8 131.63,41.91 DIO3.S
N$7
  Bottom 0.3: U$5.8 131.63,16.91 DIO4.S
N$8
  Bottom 0.3: U$6.8 161.63,116.91 DIO5.S
N$9
  Bottom 0.3: U$7.8 161.63,91.91 DIO6.S
N$10
  Bottom 0.3: U$8.8 161.63,66.91 DIO7.S
N$11
  Bottom 0.3: U$9.8 161.63,41.91 DIO8.S
N$12
  Bottom 0.3: U$10.8 161.63,16.91 DIO9.S
N$13
  Bottom 0.3: U$11.8 186.71,127 190.5,127 192,125.5 192,121 190,119 DIO10.S
N$14
  Bottom 0.3: U$12.8 190.41,102.09 192,100.5 192,94.5 191.5,94 DIO11.S
N$15
  Bottom 0.3: U$13.8 186.71,77 190.5,77 191.5,76 191.5,69.5 191,69 DIO12.S
N$16
  Bottom 0.3: U$14.8 186.71,52 190.5,52 191.5,51 191.5,44.5 191,44 DIO13.S
N$17
  Bottom 0.3: U$15.8 186.71,27 190.5,27 191.5,26 191.5,19.5 191,19 DIO14.S
N$18
  Bottom 0.3: U$16.8 221.63,116.91 DIO15.S
N$19
  Bottom 0.3: U$17.8 216.71,102 220.5,102 222,100.5 222,95 221,94 DIO16.S
N$20
  Bottom 0.3: U$18.8 216.71,77 220.5,77 221.5,76 221.5,70.5 220,69 DIO17.S
N$21
  Bottom 0.3: U$19.8 216.71,52 220.5,52 221.5,51 221.5,45.5 220,44 DIO18.S
N$22
  Bottom 0.3: U$20.8 216.71,27 220.5,27 221.5,26 221.5,20 220.5,19 DIO19.S
N$23
  Bottom 0.3: U$21.8 251.63,116.91 DIO20.S
N$24
  Bottom 0.3: U$22.8 251.63,91.91 DIO21.S
N$25
  Bottom 0.3: U$23.8 251.63,66.91 DIO22.S
N$26
  Bottom 0.3: U$24.8 101.63,116.91 DAC0.S
N$27
  Bottom 0.3: U$25.8 101.63,91.91 DAC1.S
VCC
  Top 0.6: F_EXT1.2 133.82,4 135.36,2.46 161.06,2.46 162.6,4 F_EXT2.2 155.15,11.81 152.71,11.81 152.35,12.17 152.35,14.88 103.46,63.78 103.46,78.5 | 103.46,78.5 F_EXT.2 | F_EXT5.2 F_EXT4.2 F_EXT3.2 164.86,140.04 104.46,79.64 104.46,79.5 103.46,78.5
  Bottom 0.6: C1.1 139,119.5 139.5,119 139.5,117 | 139.5,95 139.5,92 | 139.5,95 139.5,117 | 139.5,70 139.5,66.5 | 139.5,70 139.5,92 | 139.5,45 139.5,42 | 139.5,45 139.5,66.5 | 139.5,20 139.5,17 | 139.5,20 139.5,42 | 139.5,17 139.5,8 135,8 133.46,6.46 F_EXT1.2 | U$1.1 139.59,116.91 139.5,117 | U$2.1 139.59,91.91 139.5,92 | U$3.1 139.91,66.91 139.5,66.5 | U$4.1 139.59,41.91 139.5,42 | U$5.1 139.59,16.91 139.5,17 | C3.1 139.5,95 | C5.1 139.5,70 | C7.1 139.5,45 | C9.1 139.5,20 | C11.1 169,119.5 169.5,119 169.5,117 | 169.5,95 169.5,92 | 169.5,95 169.5,117 | 169.5,70 169.5,67 | 169.5,70 169.5,92 | 169.5,45 169.5,42 | 169.5,45 169.5,67 | 169.5,20 169.5,17 | 169.5,20 169.5,42 | 169.5,17 169.5,8 165,8 163,6 163,4.04 F_EXT2.2 | U$6.1 169.59,116.91 169.5,117 | U$7.1 169.59,91.91 169.5,92 | C13.1 169.5,95 | U$8.1 169.59,66.91 169.5,67 | C15.1 169.5,70 | U$9.1 169.59,41.91 169.5,42 | C17.1 169.5,45 | U$10.1 169.59,16.91 169.5,17 | C19.1 169.5,20 | U$11.1 181.48,127 184,127 | 184,127 184,124.5 | 184,124.5 184,120 181.5,117.5 181.5,110 184,107.5 184,102 | 184,102 184,99 | 184,99 184,97 181.5,94.5 181.5,85.5 184,83 184,77 | 184,77 184,74 | 184,74 184,70.5 181.5,68 181.5,61 184,58.5 184,52 | 184,52 184,49 | 184,49 184,46.5 181.5,44 181.5,36.5 184,34 184,27 | 184,27 184,25 185,24 C29.1 | C21.1 184,124.5 | C23.1 184,99 | C25.1 184,74 | C27.1 184,49 | U$12.1 181.48,102 184,102 | U$13.1 181.48,77 184,77 | U$14.1 181.48,52 184,52 | U$15.1 181.48,27 184,27 | C31.1 232.5,119.5 | 262.12,119.5 U$21.1 | C41.1 259.5,119.5 | 259.5,119.5 262.12,119.5 | U$16.1 232.5,117.29 232.5,119.5 | 211.38,99 U$17.1 | 211.38,99 211.38,85.12 214,82.5 214,77 | 214,77 214,74 | 214,74 214,71 211.5,68.5 211.5,60 214,57.5 214,52
  Bottom 0.6: 214,52 214,49 | 214,49 214,45.5 211.5,43 211.5,36 214,33.5 214,27 | C39.1 214.5,24 214,24.5 214,27 | U$20.1 211.48,27 214,27 | C37.1 214,49 | U$19.1 211.48,52 214,52 | C35.1 214,74 | U$18.1 211.48,77 214,77 | C33.1 214,99 | 214,99 211.38,99 | U$23.1 260.1,66.91 259.5,67.5 259.5,70 | 259.5,92 259.5,95 | 259.5,92 259.5,70 | 259.5,95 259.5,119.5 | C45.1 259.5,70 | C43.1 259.5,95 | U$22.1 262.02,92 259.5,92 | 214,99 214,107.5 212.5,109 210,109 208.5,110.5 208.5,136.5 212.04,140.04 F_EXT4.2 | 262.12,119.5 262.12,133.88 255.96,140.04 | 255.96,140.04 255.5,140.5 255.5,144 249,150.5 239.5,150.5 232.5,143.5 232.5,119.5 | 184,127 184,137.04 F_EXT3.2 | 247.04,140 F_EXT5.2 255.96,140.04 | C47.1 108.5,120 109.5,119 109.5,117 | 109.5,95 109.5,92 | 109.5,117 109.5,95 | 109.5,92 109.5,83 104.5,83 103.5,82 103.5,79.04 F_EXT.2 | U$25.1 112.02,92 109.5,92 | C49.1 109.5,95 | U$24.1 112.02,117 109.5,117
VEE
  Top 0.6: F_EXT2.4 157.52,4 155.98,5.54 130.28,5.54 128.74,4 F_EXT1.4 128.02,4 126.48,5.54 122.96,5.54 98.38,30.12 F_EXT.4 164.5,145.12 F_EXT3.4 F_EXT4.4 F_EXT5.4
  Bottom 0.6: U$24.5 105.09,113.09 104,112 C48.1 98.5,110 91.5,103 91.5,85 98,85 | U$25.5 105.09,88.09 104,87 C50.1 98,85 | U$1.5 134.59,113.09 134,112.5 C2.1 129,110 121.5,102.5 121.5,85 | U$2.5 135.09,88.09 134,87 C4.1 121.5,85 | U$3.5 135.09,63.09 134,62 C6.1 121.5,60 | U$4.5 134.59,38.09 134,37.5 C8.1 121.5,35 | U$5.5 135.09,13.09 134,12 C10.1 128,10 | 121.5,60 121.5,85 | 121.5,35 121.5,60 | 121.5,35 121.5,10 128,10 | U$10.5 165.09,13.09 164,12 C20.1 157.5,10 | U$9.5 166.79,38 165,38 164,37 C18.1 151.5,35 | U$8.5 166.79,63 165,63 164,62 C16.1 151.5,60 | U$7.5 166.79,88 165,88 164,87 C14.1 151.5,85 | U$6.5 166.79,113 165,113 164,112 C12.1 159.5,110 151.5,102 151.5,85 | 151.5,60 151.5,85 | 151.5,35 151.5,60 | 151.5,35 151.5,10 157.5,10 | C22.1 192,134 197.5,128.5 197.5,109 | 190,34 195,34 197.5,36.5 197.5,59 | 190,34 C30.1 | 197.5,84 197.5,59 | 197.5,109 197.5,84 | U$15.5 188.41,30.91 189.5,32 189.5,33.5 190,34 | U$14.5 188.91,55.91 189.5,56.5 C28.1 197.5,59 | 197.5,84 C26.1 189.5,81.5 189,81 186.71,81 U$13.5 | U$12.5 188.41,105.91 189.5,107 C24.1 197.5,109 | U$11.5 188.91,130.91 189.5,131.5 C22.1 | U$16.5 226.79,113 224.5,113 224,112.5 C32.1 223,109 C34.1 | 216.71,106 U$17.5 219.5,105.91 | U$18.5 218.91,80.91 219.5,81.5 C36.1 227.5,84 | U$19.5 216.71,56 218.5,56 219.5,57 C38.1 227.5,59 | U$20.5 216.71,31 219,31 219.5,31.5 C40.1 226.5,34 227.5,35 227.5,59 | 219.5,105.91 226.09,105.91 227.5,104.5 227.5,84 | 227.5,84 227.5,59 | 219.5,105.91 C34.1 | C34.1 219.5,110 218,111.5 213,111.5 211.5,113 211.5,123.5 221,133 221,144 219.88,145.12 F_EXT4.4 | 241.5,85 241.5,60.5 242,60 C46.1 254,62.5 254.6,63.09 U$23.5
  Bottom 0.6: 241.5,85 C44.1 254,87.5 254.5,88 256.79,88 U$22.5 | 241.5,110 241.5,85 | 241.5,110 241.5,143 243.62,145.12 F_EXT5.4 | 241.5,110 C42.1 254,112.5 254.6,113.09 U$21.5 | C22.1 189.5,142.62 F_EXT3.4 | F_EXT2.4 157.88,9.62 157.5,10 | F_EXT1.4 128.38,9.62 128,10 | F_EXT.4 98.38,84.62 98,85
VM+
  Bottom 0.3: X1.28 106.37,157.13 105,158.5 72,158.5 69,155.5 69,154.5 67,152.5 65.1,152.5 VM.1
VM-
  Bottom 0.3: X1.9 107.63,152.86 107.63,156.71 105.25,159.1 71.75,159.1 71.15,158.5 66,158.5 65.18,157.68 VM.3
VS
  Bottom 0.3: X2.1 187.77,152.73 194.5,150 208.4,150 VS.1 213.6,152.6 215,154 D2.A